# EAGLE design BC_LCD (EAGLE 9.1.3)
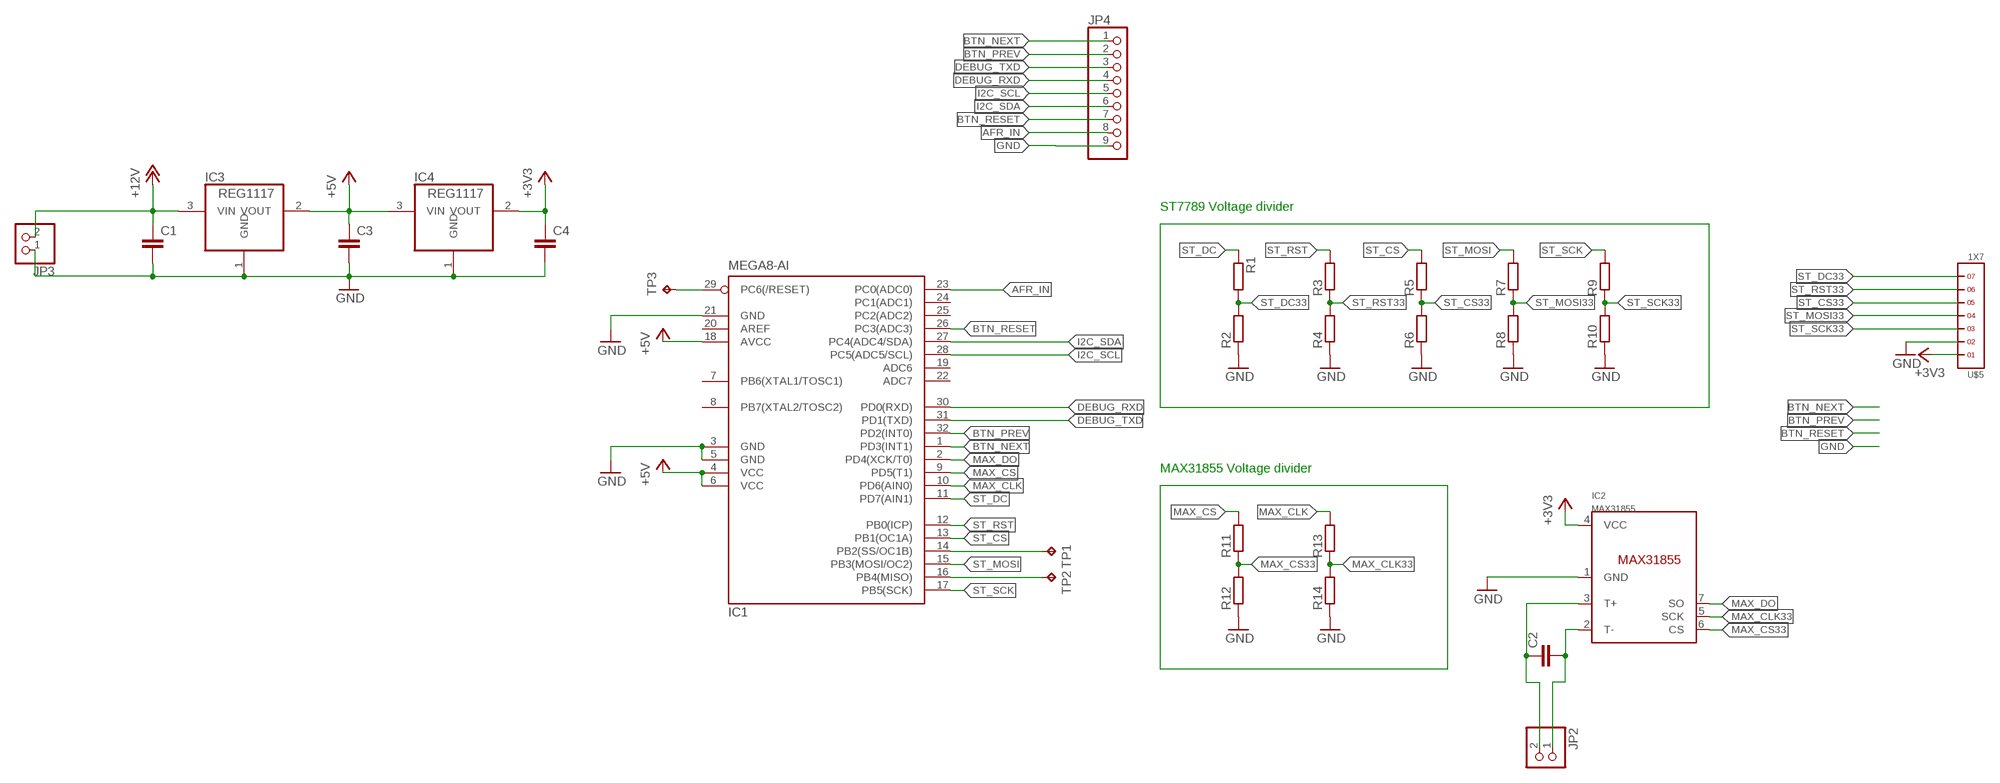
[diagram p0: schematic, sheet 1]

## Parts
C1  C-EUC0805K  [C0805K]
C2  C-EUC0805K  [C0805K]
C3  C-EUC0805K  [C0805K]
C4  C-EUC0805K  [C0805K]
IC1  MEGA8-AI  [TQFP32-08]
IC2  MAX31855  [SOIC8]
IC3  REG1117  [SOT223]
IC4  REG1117  [SOT223]
JP2  PINHD-1X2  [1X02]
JP3  PINHD-1X2  [1X02]
JP4  PINHD-1X9  [1X09]
R1  R-EU_M0805  [M0805]
R2  R-EU_M0805  [M0805]
R3  R-EU_M0805  [M0805]
R4  R-EU_M0805  [M0805]
R5  R-EU_M0805  [M0805]
R6  R-EU_M0805  [M0805]
R7  R-EU_M0805  [M0805]
R8  R-EU_M0805  [M0805]
R9  R-EU_M0805  [M0805]
R10  R-EU_M0805  [M0805]
R11  R-EU_M0805  [M0805]
R12  R-EU_M0805  [M0805]
R13  R-EU_M0805  [M0805]
R14  R-EU_M0805  [M0805]
TP1  TPTP12R  [TP12R]
TP2  TPTP12R  [TP12R]
TP3  TPTP12R  [TP12R]
U$5  1X7  [1X7]

## Nets
+3V3: C4.1 IC2.4(VCC) IC4.2(VOUT) U$5.1
+5V: C3.1 IC1.4(VCC) IC1.6(VCC) IC1.18(AVCC) IC3.2(VOUT) IC4.3(VIN)
+12V: C1.1 IC3.3(VIN) JP3.2
AFR_IN: IC1.23(PC0(ADC0)) JP4.8
BTN_NEXT: IC1.1(PD3(INT1)) JP4.1
BTN_PREV: IC1.32(PD2(INT0)) JP4.2
BTN_RESET: IC1.26(PC3(ADC3)) JP4.7
DEBUG_RXD: IC1.30(PD0(RXD)) JP4.4
DEBUG_TXD: IC1.31(PD1(TXD)) JP4.3
GND: C1.2 C3.2 C4.2 IC1.3(GND) IC1.5(GND) IC1.21(GND) IC2.1(GND) IC3.1(GND) IC4.1(GND) JP3.1 JP4.9 R2.1 R4.1 R6.1 R8.1 R10.1 R12.1 R14.1 U$5.2
I2C_SCL: IC1.28(PC5(ADC5/SCL)) JP4.5
I2C_SDA: IC1.27(PC4(ADC4/SDA)) JP4.6
MAX_CLK: IC1.10(PD6(AIN0)) R13.2
MAX_CLK33: IC2.5(SCK) R13.1 R14.2
MAX_CS: IC1.9(PD5(T1)) R11.2
MAX_CS33: IC2.6(CS) R11.1 R12.2
MAX_DO: IC1.2(PD4(XCK/T0)) IC2.7(SO)
N$3: C2.1 IC2.3(T+) JP2.2
N$4: C2.2 IC2.2(T-) JP2.1
N$5: IC1.14(PB2(SS/OC1B)) TP1.TP
N$6: IC1.16(PB4(MISO)) TP2.TP
N$7: IC1.29(PC6(/RESET)) TP3.TP
ST_CS: IC1.13(PB1(OC1A)) R5.2
ST_CS33: R5.1 R6.2 U$5.5
ST_DC: IC1.11(PD7(AIN1)) R1.1
ST_DC33: R1.2 R2.2 U$5.7
ST_MOSI: IC1.15(PB3(MOSI/OC2)) R7.2
ST_MOSI33: R7.1 R8.2 U$5.4
ST_RST: IC1.12(PB0(ICP)) R3.2
ST_RST33: R3.1 R4.2 U$5.6
ST_SCK: IC1.17(PB5(SCK)) R9.2
ST_SCK33: R9.1 R10.2 U$5.3
Unconnected: IC1.7(PB6(XTAL1/TOSC1)) IC1.8(PB7(XTAL2/TOSC2)) IC1.19(ADC6) IC1.20(AREF) IC1.22(ADC7) IC1.24(PC1(ADC1)) IC1.25(PC2(ADC2))

## Notes on the sheet
- ST7789 Voltage divider
- MAX31855 Voltage divider

## Library data of the parts
C1-C4 = rcl:C-EU: CAPACITOR, European symbol; SPICEPREFIX: C
IC1 = atmel:MEGA8: MICROCONTROLLER 8 Kbytes FLASH, 1 kbytes SRAM, 512 bytes EEPROM, USART, 6-channel 10 bit ADC, 2-channel 8 bit ADC Pin compatible with Atmega48, ATMega88, ATMega168 Source: avr.lbr; MPN: ATMEGA8-16AU; OC_FARNELL: 9171371; OC_NEWARK: 73M8863
IC2 = AlexW-Eagle-Libraries:MAX31855
IC3 IC4 = burr-brown:REG1117: 800mA and 1A Low Dropout (LDO) Positive Regulator 1.8V, 2.5V, 2.85V, 3.3V, 5V, and Adj; MPN: REG1117; OC_FARNELL: 1097566; OC_NEWARK: 14P6981
JP2 JP3 = pinhead:PINHD-1X2: PIN HEADER
JP4 = pinhead:PINHD-1X9: PIN HEADER
R1-R14 = rcl:R-EU_: RESISTOR, European symbol; SPICEPREFIX: R
TP1-TP3 = testpad:TP: Test pad
U$5 = headers(2mm):1X7

## Board
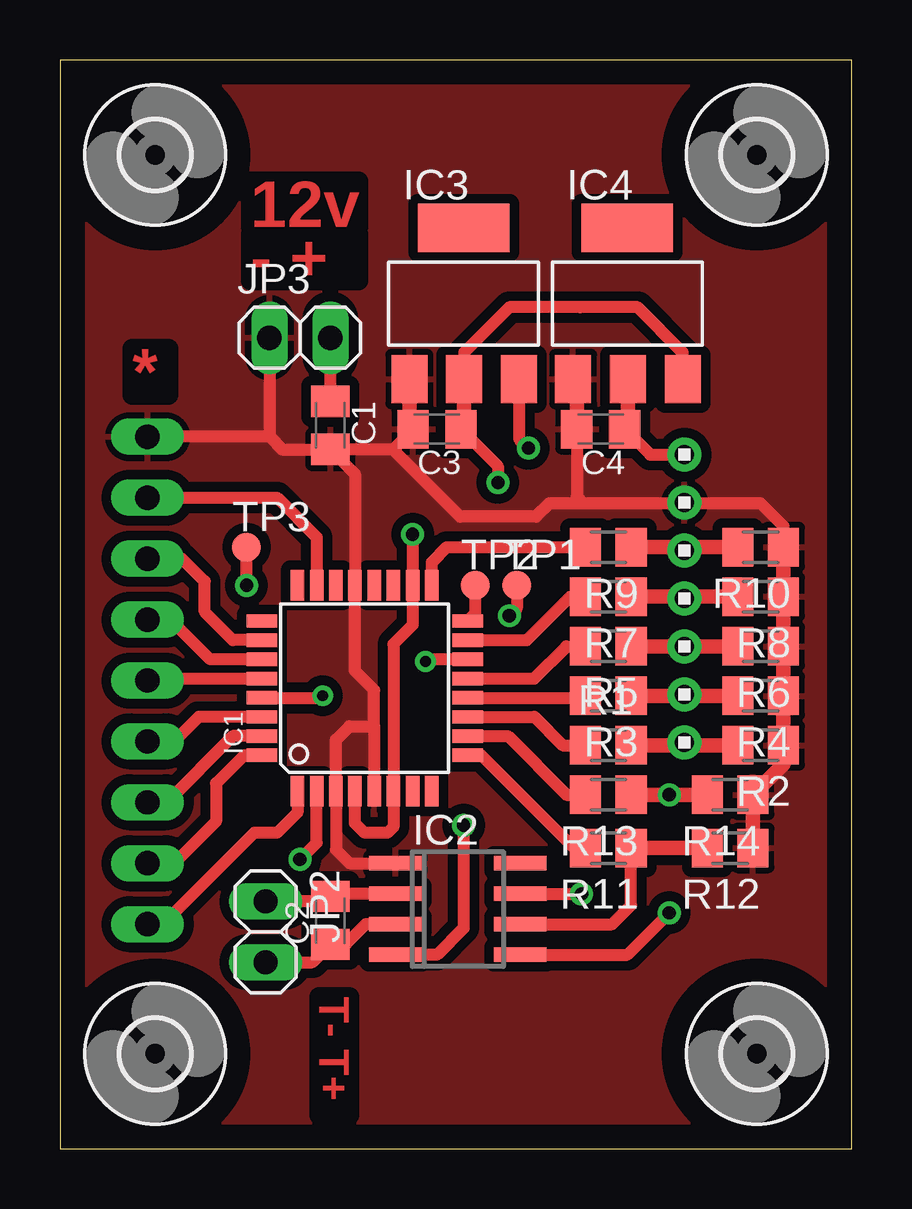
[diagram p1: board, top side]
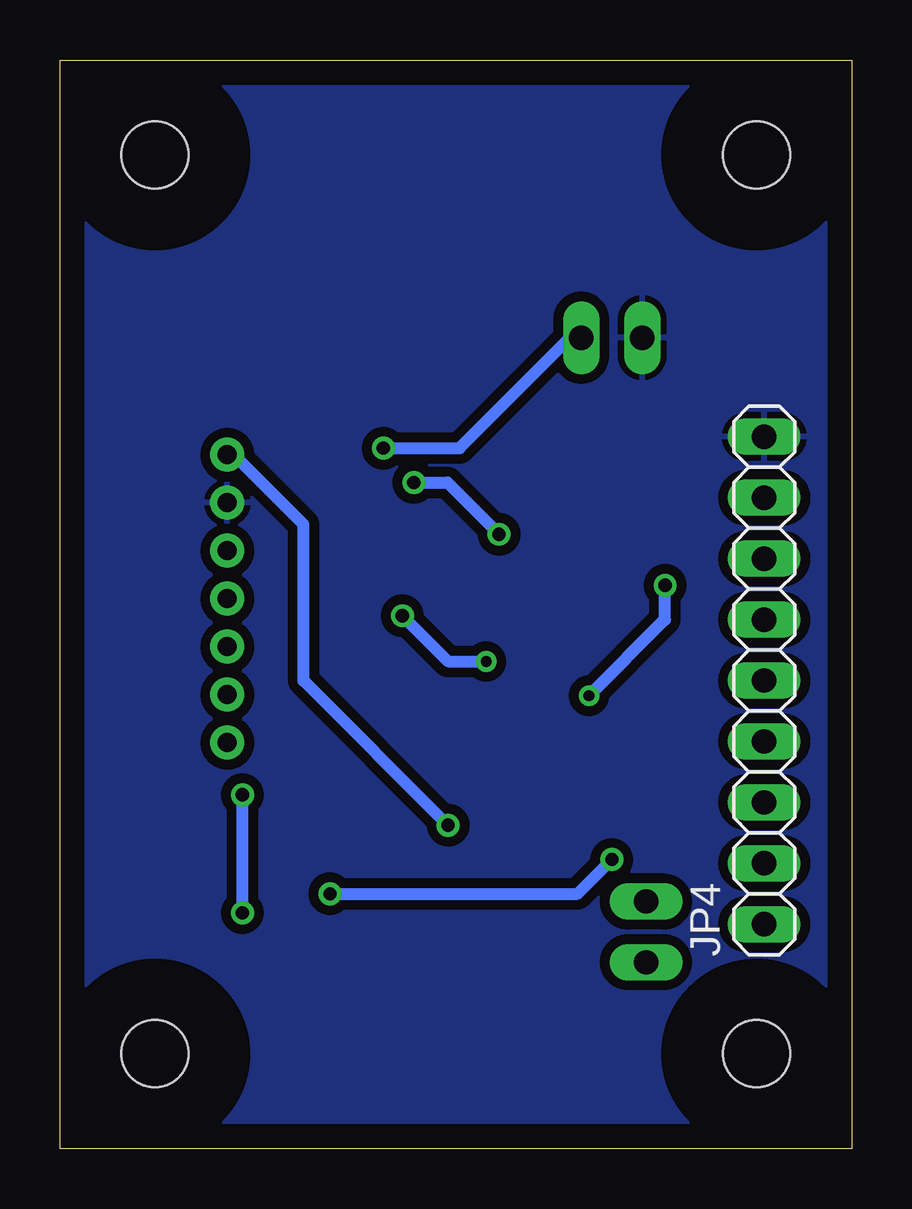
[diagram p2: board, bottom side, seen from below]

Size 33.01 x 45.39 mm. Coordinates in mm from the lower left corner, seen from the top.
Outline: 0,0 33.01,0 33.01,45.39 0,45.39 0,0
Copper layers (1*16): Top 0.035mm / dielectric 1.5mm / Bottom 0.035mm
Design rules "default": minimum track width 6mil, minimum drill 0.35mm, track to track 6mil, track to pad 6mil, pad to pad 6mil, via to via 6mil, smd to smd 6mil, copper to edge 40mil, drill to drill 6mil, minimum pad ring 10mil, minimum via ring 8mil, stop-mask expansion 4mil, vias tented up to drill 0mil, thermal gap 10mil

### Footprints (pad centres in the part's own frame; a part is rotated, then mirrored left to right if it is on the bottom)
C0805K = smd 1.3 x 1.6: 1 -1,0; 2 1,0
TQFP32-08 = smd 1.27 x 0.559: 1 -4.293,2.8; 2 -4.293,2; 3 -4.293,1.2; 4 -4.293,0.4; 5 -4.293,-0.4; 6 -4.293,-1.2; 7 -4.293,-2; 8 -4.293,-2.8; 17 4.293,-2.8; 18 4.293,-2; 19 4.293,-1.2; 20 4.293,-0.4; 21 4.293,0.4; 22 4.293,1.2; 23 4.293,2; 24 4.293,2.8 | smd 0.559 x 1.27: 9 -2.8,-4.293; 10 -2,-4.293; 11 -1.2,-4.293; 12 -0.4,-4.293; 13 0.4,-4.293; 14 1.2,-4.293; 15 2,-4.293; 16 2.8,-4.293; 25 2.8,4.293; 26 2,4.293; 27 1.2,4.293; 28 0.4,4.293; 29 -0.4,4.293; 30 -1.2,4.293; 31 -2,4.293; 32 -2.8,4.293
SOIC8 = smd 0.6 x 2.2: 1 -1.905,-2.6; 2 -0.635,-2.6; 3 0.635,-2.6; 4 1.905,-2.6; 5 1.905,2.6; 6 0.635,2.6; 7 -0.635,2.6; 8 -1.905,2.6
SOT223 = smd 1.499 x 2.007: 1 -2.261,-3.15; 2 0.025,-3.15; 3 2.311,-3.15 | smd 3.81 x 2.007: 4 0,3.15
1X02 = drill 1.016 long: 1 -1.27,0; 2 1.27,0
1X09 = drill 1.016 long: 1 -10.16,0; 2 -7.62,0; 3 -5.08,0; 4 -2.54,0; 5 0,0; 6 2.54,0; 7 5.08,0; 8 7.62,0; 9 10.16,0
M0805 = smd 1.3 x 1.6: 1 -0.95,0; 2 0.95,0
TP12R = smd 1.2 x 1.2: TP 0,0
2,8 = hole 2.8: 0,0
1X7 = drill 0.8 pad 1.422: 1 -6,0; 2 -4,0; 3 -2,0; 4 0,0; 5 2,0; 6 4,0; 7 6,0

### Placement (x,y rotation side)
C1  11.27,30.16 270 top
C2  11.27,9.53 90 top
C3  15.72,30 180 top
C4  22.54,30 180 top
IC1  12.7,19.21 90 top
IC2  16.59,10 270 top
IC3  16.83,35.24 0 top
IC4  23.65,35.24 0 top
JP2  8.57,9.05 270 top
JP3  10,33.81 0 top
JP4  3.65,19.53 90 bottom
R1  22.86,16.83 0 top
R2  29.21,16.83 180 top
R3  22.86,18.89 180 top
R4  29.21,18.89 180 top
R5  22.86,20.95 180 top
R6  29.21,20.95 180 top
R7  22.86,23.02 180 top
R8  29.21,23.02 180 top
R9  22.86,25.08 180 top
R10  29.21,25.08 180 top
R11  22.86,12.54 180 top
R12  27.94,12.54 180 top
R13  22.86,14.76 180 top
R14  27.94,14.76 180 top
TP1  19.05,23.5 0 top
TP2  17.3,23.5 0 top
TP3  7.78,25.08 0 top
U$1  [2,8]  3.97,41.43 0 top
U$2  [2,8]  29.05,41.43 0 top
U$3  [2,8]  29.05,3.97 0 top
U$4  [2,8]  3.97,3.97 0 top
U$5  26.04,22.94 270 top

### Tracks (layer width: path | path; a pad name or v marks a point on that pad's centre or on a via)
+3V3  (via drill 0.55)
  Top 0.508: v16.83,13.49 16.83,9.21 15.72,8.1 IC2.4 | 23.65,30 C4.1 24.61,28.94 U$5.1
  Top 0.61: IC4.2 23.68,30.14 C4.1
  Bottom 0.508: v16.83,13.49 22.86,19.53 22.86,26.04 25.76,28.94 U$5.1
+5V  (via drill 0.55)
  Top 0.508: IC1.4 12.3,13.58 12.7,13.18 13.65,13.18 13.9,13.42 IC1.6 13.9,21.04 14.7,21.84 IC1.18 v14.7,25.62 | IC3.2 16.85,33.2 18.73,35.08 21.68,35.08 24.09,35.08 25.96,33.2 IC4.3 | C3.1 18.26,28.46 v18.26,27.78
  Top 0.61: IC3.2 16.85,30.14 C3.1
  Bottom 0.508: v18.26,27.78 16.86,27.78 v14.7,25.62
+12V  (via drill 0.55)
  Top 0.508: IC3.3 19.14,29.6 v19.53,29.21 | C1.1 JP3.2
  Bottom 0.508: v19.53,29.21 16.35,29.21 11.75,33.81 JP3.2
AFR_IN
  Top 0.508: JP4.8 9.05,27.15 10.7,25.5 IC1.23
BTN_NEXT
  Top 0.508: IC1.1 9.9,14.03 9.05,13.18 8.1,13.18 4.29,9.37 JP4.1
BTN_PREV
  Top 0.508: IC1.32 7.68,16.41 6.51,15.24 6.51,13.65 4.76,11.91 JP4.2
BTN_RESET
  Top 0.508: IC1.26 7.21,21.21 6.03,22.38 6.03,23.65 5.08,24.61 JP4.7
DEBUG_RXD
  Top 0.508: IC1.30 5.79,18.01 4.76,16.99 JP4.4
DEBUG_TXD
  Top 0.508: IC1.31 7.21,17.21 4.45,14.45 JP4.3
GND
  Top 0.152: U$5.2 26.04,26.91
  Top 0.508: 13.1,17.62 13.1,19.13 12.3,19.93 IC1.21 12.3,28.13 C1.2 | 13.1,17.62 IC1.5 | 13.1,17.62 12.06,17.62 11.5,17.06 IC1.3 11.5,12.47 12.06,11.91 IC2.1 | C3.2 13.88,29.16 | 13.88,29.16 C1.2 | R10.1 30.16,25.96 29.21,26.91 26.04,26.91 21.83,26.91 | C4.2 21.54,27.19 21.83,26.91 | JP3.1 8.73,29.69 | 8.73,29.69 9.26,29.16 C1.2 | 8.73,29.69 JP4.9 | 21.83,26.91 20.4,26.91 19.84,26.35 16.68,26.35 13.88,29.16
  Top 0.61: R10.1 R8.1 R6.1 R4.1 R2.1 30.16,16.03 R14.1 R12.1 | C4.2 21.54,31.94 IC4.1 | IC3.1 14.57,30.15 C3.2
  pour Bottom (isolate 0.406): 0,45.4 0,0 33.02,0 33.02,45.4
  pour Top (isolate 0.406): 0,45.4 0,0 33.02,0 33.02,45.4
I2C_SCL
  Top 0.508: JP4.5 3.73,19.61 IC1.28
I2C_SDA
  Top 0.508: IC1.27 6.26,20.41 4.6,22.07 JP4.6
MAX_CLK
  Top 0.508: IC1.10 18.67,17.21 21.11,14.76 R13.2
MAX_CLK33  (via drill 0.55)
  Top 0.508: IC2.5 23.65,8.1 v25.4,9.84
  Top 0.61: R13.1 v25.4,14.76 R14.2
  Bottom 0.508: v25.4,9.84 v25.4,14.76
MAX_CS
  Top 0.508: R11.2 21.43,12.54 17.56,16.41 IC1.9
MAX_CS33
  Top 0.508: IC2.6 23.02,9.37 23.81,10.16 R11.1
  Top 0.61: R11.1 R12.2
MAX_DO  (via drill 0.55)
  Top 0.508: IC2.7 v21.75,10.64 | v10,12.06 10.7,12.76 IC1.2
  Bottom 0.508: v21.75,10.64 11.43,10.64 v10,12.06
N$3
  Top 0.508: IC2.3 12.75,9.37 11.91,8.53 C2.1 10.53,7.78 JP2.2
N$4
  Top 0.508: IC2.2 11.38,10.64 C2.2 11.06,10.32 JP2.1
N$5  (via drill 0.45, 0.55)
  Top 0.508: TP1.TP 19.05,22.54 v18.73,22.23 | IC1.14 15.33,20.41 v15.24,20.32
  Bottom 0.508: v18.73,22.23 16.83,20.32 v15.24,20.32
N$6
  Top 0.508: TP2.TP 17.3,22.32 IC1.16
N$7  (via drill 0.45, 0.55)
  Top 0.508: IC1.29 10.87,18.81 v10.95,18.89 | v7.78,23.5 TP3.TP
  Bottom 0.508: v10.95,18.89 7.78,22.07 v7.78,23.5
ST_CS
  Top 0.508: IC1.13 19.77,19.61 21.11,20.95 R5.2
ST_CS33
  Top 0.152: U$5.5 25.97,20.94 25.96,20.95
  Top 0.61: R5.1 25.96,20.95 R6.2
ST_DC
  Top 0.508: IC1.11 19.77,18.01 20.95,16.83 R1.1
ST_DC33
  Top 0.152: U$5.7 26.04,16.83
  Top 0.61: R1.2 26.04,16.83 R2.2
ST_MOSI
  Top 0.508: IC1.15 19.46,21.21 21.27,23.02 R7.2
ST_MOSI33
  Top 0.152: U$5.4 26.04,23.02
  Top 0.61: R7.1 26.04,23.02 R8.2
ST_RST
  Top 0.508: IC1.12 21.83,18.81 R3.2
ST_RST33
  Top 0.152: U$5.6 26.04,18.89
  Top 0.61: R3.1 26.04,18.89 R4.2
ST_SCK
  Top 0.508: R9.2 16.13,25.08 15.5,24.45 IC1.17
ST_SCK33
  Top 0.152: U$5.3 26.04,25.08
  Top 0.61: R9.1 26.04,25.08 R10.2

### Text on the board
Top: 12v | - + | * | T- T+